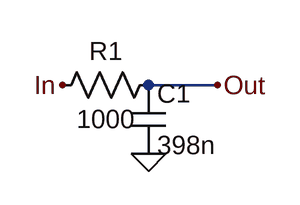
[diagram p0: schematic LpassFilter.asc]
LpassFilter.asc, the LTspice schematic file:
Version 4
SHEET 1 880 680
WIRE 208 112 144 112
FLAG 144 176 0
FLAG 64 112 In
FLAG 208 112 Out
SYMBOL res 160 96 R90
WINDOW 0 0 56 VBottom 2
WINDOW 3 32 56 VTop 2
SYMATTR InstName R1
SYMATTR Value 1000
SYMBOL cap 128 112 R0
SYMATTR InstName C1
SYMATTR Value 398n

The netlist it stands for:
* LpassFilter.asc
R1 Out In 1000
C1 Out 0 398n
.backanno
.end